# EAGLE design decoderP3-v2 (EAGLE 7.6.0)
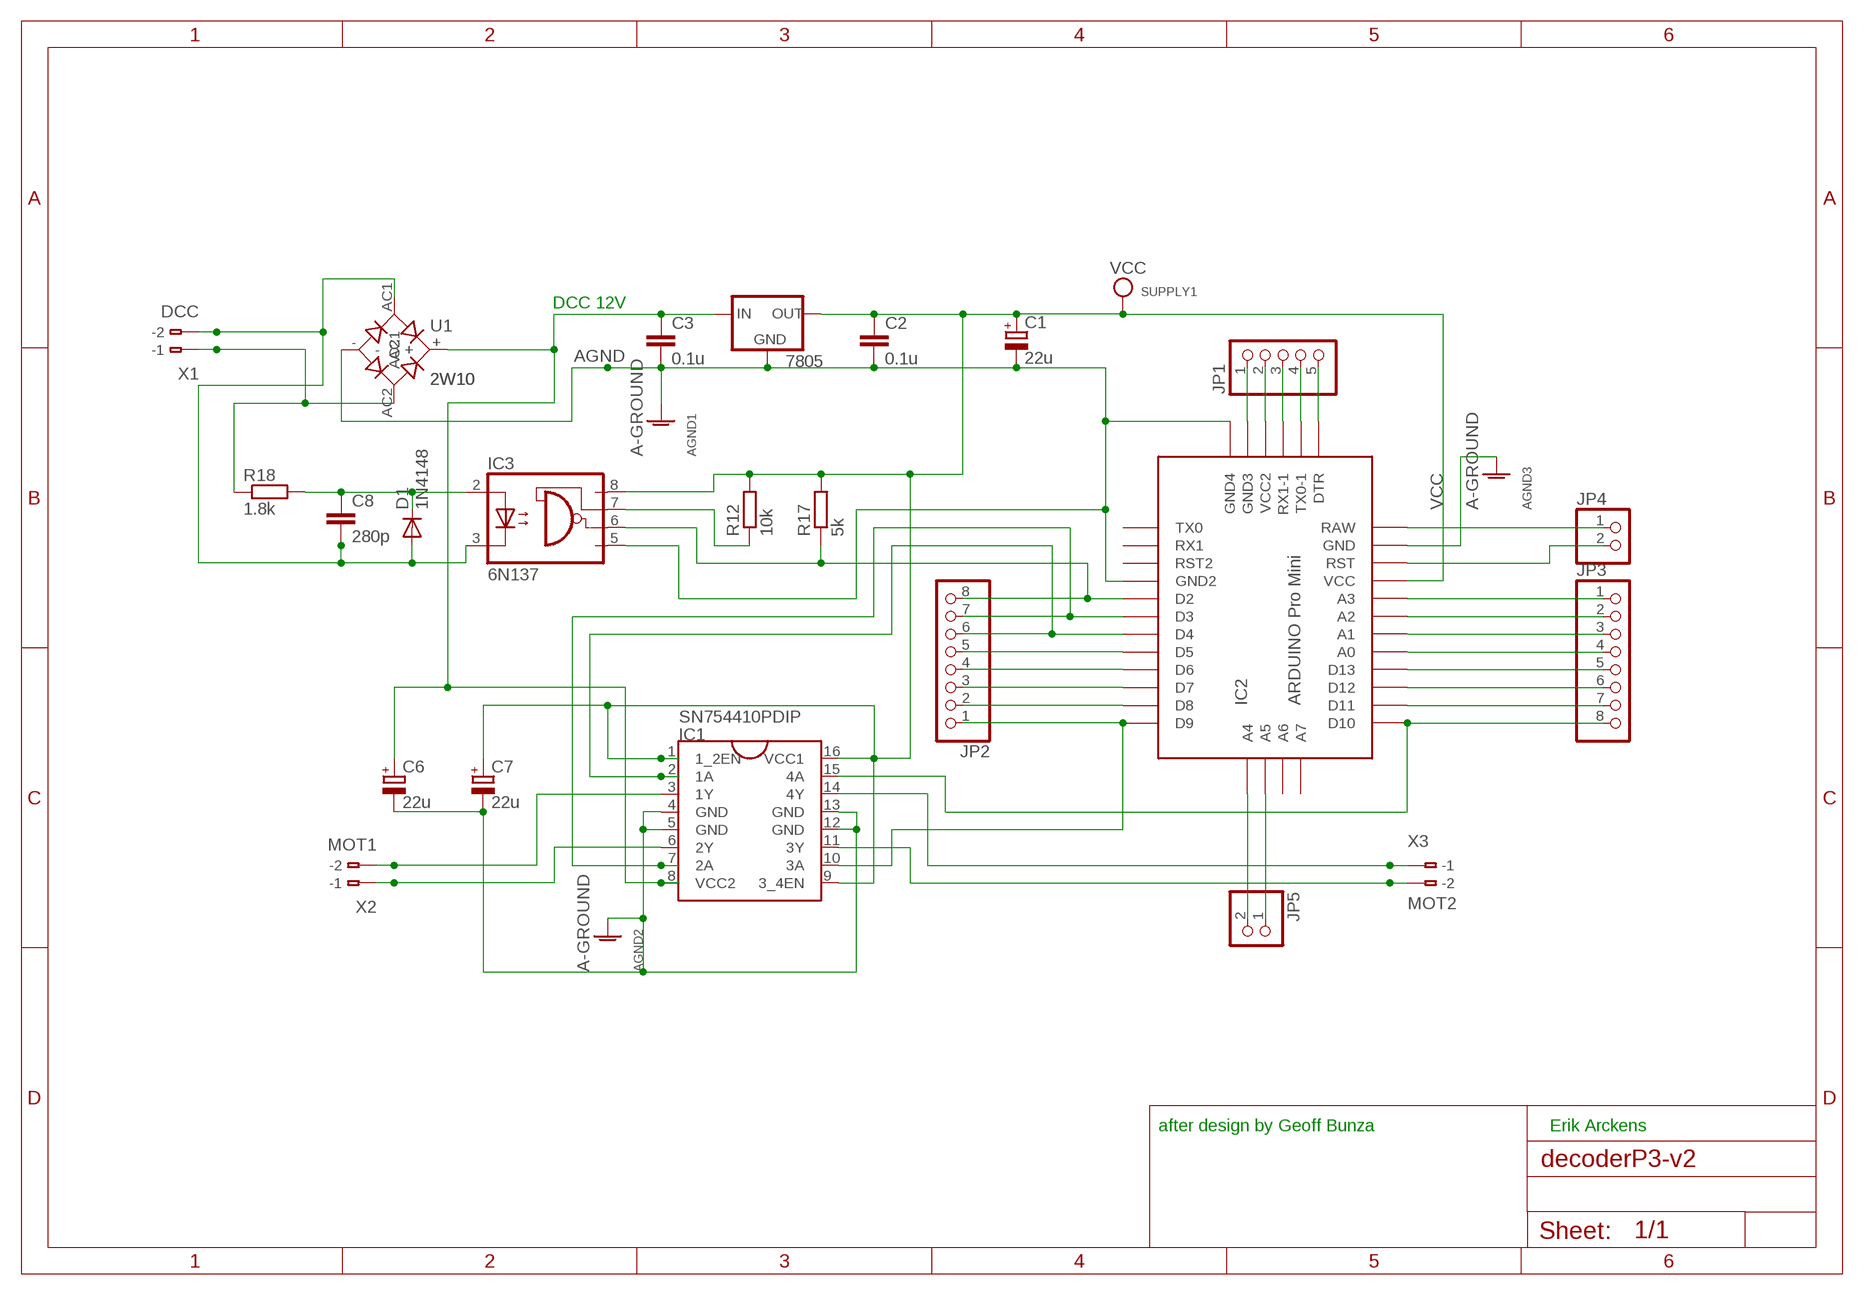
[diagram p0: schematic, sheet 1]

## Parts
7805  78XXS  [78XXS]
C1  22u  ELCOELCO2,5MMLEAD  [ELCO-2.5MMLEAD]
C2  0.1u  CERAMIC-CAP2LEADS  [CERAMIC-CAP-C050-025X075]
C3  0.1u  CERAMIC-CAP2LEADS  [CERAMIC-CAP-C050-025X075]
C6  22u  TANTALUM-SMD-22UF-25V-AVX-CSMD  [AVX-C]
C7  22u  TANTALUM-SMD-22UF-25V-AVX-CSMD  [AVX-C]
C8  280p  CERAMIC-CAP2LEADS  [CERAMIC-CAP-C050-025X075]
D1  1N4148  1N4148-1ADO35-7  [DO35-7-1N4148]
IC1  SN754410PDIP  [DIL16]
IC2  ARDUINO Pro Mini  ARDUINO-PRO-MINI-FULLFULL  [ARDUINO-PRO-MINI-FULL]
IC3  6N137  6N137-OPTOCOUPLER  [DIL08]
JP1  PINHD-1X5  [1X05]
JP2  PINHD-1X8  [1X08]
JP3  PINHD-1X8  [1X08]
JP4  PINHD-1X2  [1X02]
JP5  PINHD-1X2  [1X02]
R12  10k  RESISTOR_1/4W_V  [0207/2V_VERTICAL_1/4W_RESISTOR]
R17  5k  RESISTOR_1/4W_V  [0207/2V_VERTICAL_1/4W_RESISTOR]
R18  1.8k  RESISTOR_1/4W_V  [0207/2V_VERTICAL_1/4W_RESISTOR]
U1  2W10  2W10_BRIDGE_RECTIFIER  [2W10]
X1  DCC  TERMINAL-2POLE-0.1-INCH-SPRINGLOADED  [PCB-TERMINAL-2POLE-0.1-INCH]
X2  MOT1  TERMINAL-2POLE-0.1-INCH-SPRINGLOADED  [PCB-TERMINAL-2POLE-0.1-INCH]
X3  MOT2  TERMINAL-2POLE-0.1-INCH-SPRINGLOADED  [PCB-TERMINAL-2POLE-0.1-INCH]

## Nets
AGND [GND]: 7805.GND C1.- C2.P$1 C3.P$1 C6.- C7.- IC1.4(GND) IC1.5(GND) IC1.12(GND) IC1.13(GND) IC2.GND IC2.GND1(GND2) IC2.GND2(GND4) IC3.5(GND) U1.- ; supply symbol labelled A-GROUND
N$1: C8.P$1 D1.A IC3.3(C) U1.AC1 X1.A2(-2) X1.B2(B-2)
N$2: IC2.D5 JP2.5
N$3: IC2.D6 JP2.4
N$4 [VCC]: 7805.IN C3.P$2 C6.+ IC1.8(VCC2) U1.+
N$5: R18.1 U1.AC2 X1.A1(-1) X1.B1(B-1)
N$6: IC1.2(1A) IC2.D4 JP2.6
N$7: IC2.D7 JP2.3
N$8: IC1.3(1Y) X2.A2(-2) X2.B2(B-2)
N$9: IC1.6(2Y) X2.A1(-1) X2.B1(B-1)
N$10: IC1.11(3Y) X3.A2(-2) X3.B2(B-2)
N$11: IC1.10(3A) IC2.D9 JP2.1
N$12: IC3.7(VE) R12.1
N$13: IC1.7(2A) IC2.D3 JP2.7
N$14: IC2.D8 JP2.2
N$15: IC2.A3 JP3.1
N$16: IC1.15(4A) IC2.D10 JP3.8
N$17: IC1.14(4Y) X3.A1(-1) X3.B1(B-1)
N$18: IC2.A2 JP3.2
N$19: IC2.A1 JP3.3
N$20: IC2.D2 IC3.6(VO) JP2.8 R17.1
N$21: IC2.A0 JP3.4
N$22: IC2.D13 JP3.5
N$23: IC2.D12 JP3.6
N$24: IC2.D11 JP3.7
N$25: IC2.RAW JP4.1
N$26: IC2.RST JP4.2
N$27: IC2.GND3 JP1.1
N$28: IC2.VCC1(VCC2) JP1.2
N$29: IC2.RX1-1 JP1.3
N$30: IC2.TX0-1 JP1.4
N$31: IC2.DTR JP1.5
N$32: IC2.A4 JP5.2
N$33: IC2.A5 JP5.1
N$34: C8.P$2 D1.C IC3.2(A) R18.2
VCC [VCC]: 7805.OUT C1.+ C2.P$2 C7.+ IC1.1(1_2EN) IC1.9(3_4EN) IC1.16(VCC1) IC2.VCC IC3.8(VCC) R12.2 R17.2
Unconnected: IC2.A6 IC2.A7 IC2.RST1(RST2) IC2.RX1 IC2.TX0

## Notes on the sheet
- DCC 12V
- after design by Geoff Bunza | Erik Arckens

## Library data of the parts
7805 = decoderP3 v2:78XXS: VOLTAGE REGULATOR
C1 = decoderP3 v2:ELCO: electrolytic capacitor 3.5mm lead
C2 C3 C8 = decoderP3 v2:CERAMIC-CAP: ceramic capacitor leads 2.5mm and 5.5mm
C6 C7 = decoderP3 v2:TANTALUM-SMD-22UF-25V-AVX-C: Tantalum SMD 22uF 25V
D1 = decoderP3 v2:1N4148-1A: DIODE high speed (Philips)
IC1 = decoderP3 v2:SN754410: SN754410 quadruple half-H bridge driver
IC2 = decoderP3 v2:ARDUINO-PRO-MINI-FULL: Arduion Pro Mini Clone V1.0
IC3 = decoderP3 v2:6N137-OPTOCOUPLER: MOTOROLA OPTO COUPLER; MPN: 6N137; OC_FARNELL: 1328376; OC_NEWARK: 52M1895
JP1 = decoderP3 v2:PINHD-1X5: PIN HEADER
JP2 JP3 = decoderP3 v2:PINHD-1X8: PIN HEADER
JP4 JP5 = decoderP3 v2:PINHD-1X2: 2-PIN HEADER
R12 R17 R18 = decoderP3 v2:RESISTOR_1/4W_V: Resistor 1/4W vertical
U1 = decoderP3 v2:2W10_BRIDGE_RECTIFIER: 2W10 bridge rectifier 2A
X1-X3 = decoderP3 v2:TERMINAL-2POLE-0.1-INCH-SPRINGLOADED: WAGO Cage Clamp; MPN: 233-102; OC_FARNELL: unknown; OC_NEWARK: 28K9044

## Net classes
0 default: width 0.254 mm, clearance 0.203 mm
1 GND: width 0.406 mm, clearance 0.203 mm
2 VCC: width 0.406 mm, clearance 0.203 mm

## Board
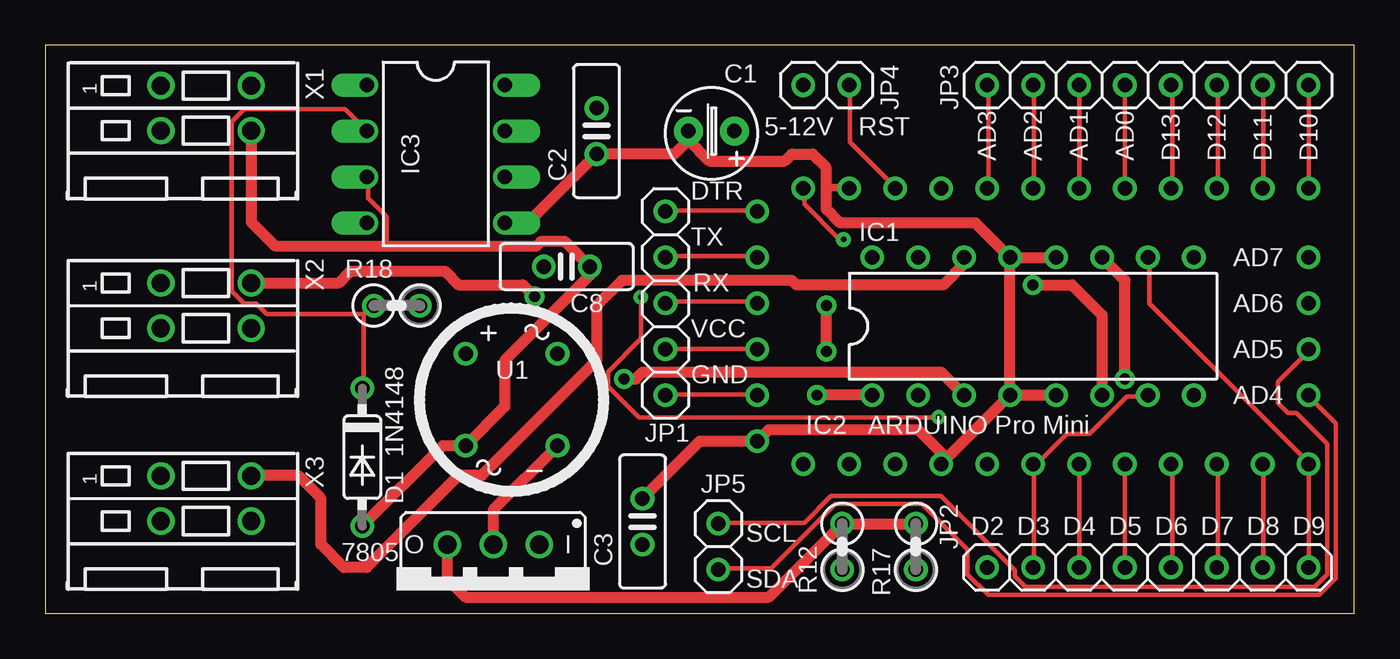
[diagram p1: board, top side]
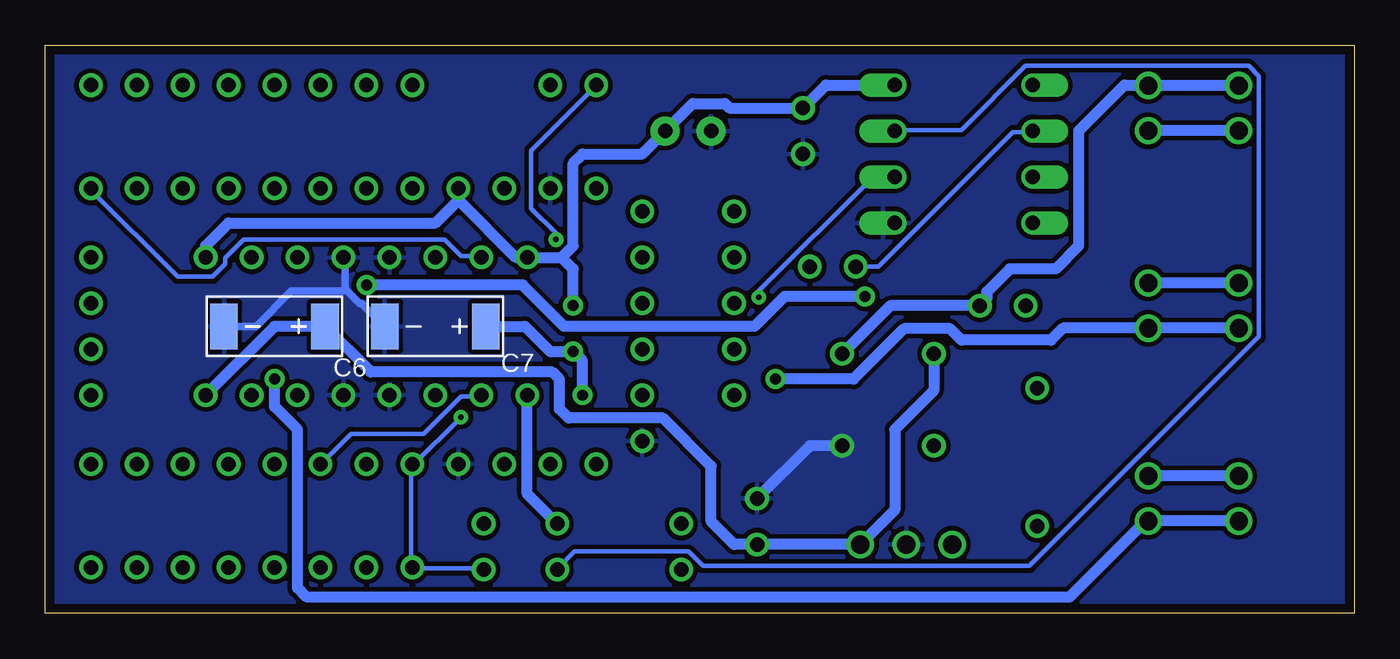
[diagram p2: board, bottom side, seen from below]

Size 72.37 x 31.42 mm. Coordinates in mm from the lower left corner, seen from the top.
Outline: 0,0 72.37,0 72.37,31.42 0,31.42 0,0
Copper layers (1*16): Top 0.035mm / dielectric 1.6mm / Bottom 0.035mm
Design rules "Elecrow_2-layer_PCB_eagle_rule-v2 *": minimum track width 6mil, minimum drill 12mil, track to track 6mil, track to pad 6mil, pad to pad 6mil, via to via 8mil, smd to smd 0mil, copper to edge 20mil, drill to drill 10mil, minimum pad ring 10mil, minimum via ring 10mil, stop-mask expansion 0mil, vias tented up to drill 25mil, thermal gap 10mil

### Footprints (pad centres in the part's own frame; a part is rotated, then mirrored left to right if it is on the bottom)
78XXS = drill 1.016: GND 0,-2.54; IN -2.54,-2.54; OUT 2.54,-2.54
ELCO-2.5MMLEAD = drill 0.8 pad 1.6: + -1.27,0; - 1.27,0
CERAMIC-CAP-C050-025X075 = drill 0.8: P$1 -1.27,0; P$2 1.27,0
AVX-C = smd 1.524 x 2.54: + -2.794,0; - 2.794,0
DO35-7-1N4148 = drill 0.8: A 3.81,0; C -3.81,0
DIL16 = drill 0.8: 1 -8.89,-3.81; 2 -6.35,-3.81; 3 -3.81,-3.81; 4 -1.27,-3.81; 5 1.27,-3.81; 6 3.81,-3.81; 7 6.35,-3.81; 8 8.89,-3.81; 9 8.89,3.81; 10 6.35,3.81; 11 3.81,3.81; 12 1.27,3.81; 13 -1.27,3.81; 14 -3.81,3.81; 15 -6.35,3.81; 16 -8.89,3.81
ARDUINO-PRO-MINI-FULL = drill 0.8: A0 8.89,8.89; A1 8.89,11.43; A2 8.89,13.97; A3 8.89,16.51; A4 -2.54,-1.27; A5 0,-1.27; A6 2.54,-1.27; A7 5.08,-1.27; D2 -6.35,16.51; D3 -6.35,13.97; D4 -6.35,11.43; D5 -6.35,8.89; D6 -6.35,6.35; D7 -6.35,3.81; D8 -6.35,1.27; D9 -6.35,-1.27; D10 8.89,-1.27; D11 8.89,1.27; D12 8.89,3.81; D13 8.89,6.35; DTR 7.62,29.21; GND 8.89,24.13; GND1 -6.35,19.05; GND2 -5.08,29.21; GND3 -2.54,29.21; RAW 8.89,26.67; RST 8.89,21.59; RST1 -6.35,21.59; RX1 -6.35,24.13; RX1-1 2.54,29.21; TX0 -6.35,26.67; TX0-1 5.08,29.21; VCC 8.89,19.05; VCC1 0,29.21
DIL08 = drill 0.8 pad 1.27 offset: 1 -3.81,-3.81; 2 -1.27,-3.81; 3 1.27,-3.81; 4 3.81,-3.81; 5 3.81,3.81; 6 1.27,3.81; 7 -1.27,3.81; 8 -3.81,3.81
1X05 = drill 0.8: 1 -5.08,0; 2 -2.54,0; 3 0,0; 4 2.54,0; 5 5.08,0
1X08 = drill 0.8: 1 -8.89,0; 2 -6.35,0; 3 -3.81,0; 4 -1.27,0; 5 1.27,0; 6 3.81,0; 7 6.35,0; 8 8.89,0
1X02 = drill 0.8: 1 -1.27,0; 2 1.27,0
0207/2V_VERTICAL_1/4W_RESISTOR = drill 0.8: 1 -1.27,0; 2 1.27,0
2W10 = drill 0.8: + -2.54,2.54; - 2.54,-2.54; AC1 -2.54,-2.54; AC2 2.54,2.54
PCB-TERMINAL-2POLE-0.1-INCH = drill 1: A1 -1.25,2.5; A2 1.25,2.5; B1 -1.25,-2.5; B2 1.25,-2.5

### Placement (x,y rotation side)
7805  24.77,1.27 180 top
C1  36.83,26.67 180 top
C2  30.48,26.67 90 top
C3  33.02,5.08 270 top
C6  59.69,15.88 180 bottom
C7  50.8,15.88 180 bottom
C8  28.83,19.18 180 top
D1  17.53,8.64 270 top
IC1  54.61,15.88 0 top
IC2  68.58,14.61 90 top
IC3  21.59,25.4 270 top
JP1  34.29,17.14 90 top
JP2  60.96,2.54 180 top
JP3  60.96,29.21 0 top
JP4  43.18,29.21 0 top
JP5  37.21,3.68 270 top
R12  44.07,3.68 90 top
R17  48.13,3.68 90 top
R18  19.43,17.02 180 top
U1  25.78,11.81 0 top
X1  8.89,27.94 270 top
X2  8.89,17.02 270 top
X3  8.89,6.35 270 top

### Tracks (layer width: path | path; a pad name or v marks a point on that pad's centre or on a via)
AGND
  Top 0.406: 43.18,23.53 44.36,23.53 IC2.GND
  Top 0.61: U1.- 24.77,5.71 7805.GND | C3.P$1 36.2,9.53 IC2.GND2 40.01,10.16 48.26,10.16 49.53,8.89 IC2.GND1 IC1.4 | IC1.4 IC1.5 | IC1.4 IC1.13 | IC1.13 IC1.12 | IC1.13 51.44,21.59 43.94,21.59 43.18,22.35 43.18,23.53 43.18,24.64 42.42,25.4 41.28,25.4 40.89,25.02 36.7,25.02 35.56,26.16 | 35.56,26.16 C1.- | 35.56,26.16 34.8,25.4 C2.P$1 26.67,21.59 IC3.5
  Bottom 0.406: 55.79,17.93 54.99,17.13 54.88,17.13 53.62,15.88 C7.- | 55.79,17.93 55.79,19.65 IC1.12 | C6.- 60.71,15.88 58.76,17.82 55.91,17.82 55.79,17.93
  Bottom 0.61: U1.- 30.1,9.27 C3.P$1
  pour Bottom (isolate 0.254): 0,31.37 72.39,31.37 72.39,31.24 72.26,31.24 72.26,0 0,0
N$1
  Top 0.254: 18.87,20.32 18.87,21.93 17.84,22.96 17.84,24.11 IC3.3
  Top 0.61: X1.A2 11.39,21.63 12.7,20.32 18.87,20.32 27.18,20.32 27.43,20.57 28.7,20.57 C8.P$1 30.1,18.67 25.4,13.97 25.4,11.43 U1.AC1 21.97,9.27 D1.A
  Bottom 0.61: X1.B2 X1.A2
N$2
  Top 0.254: JP2.5 59.68,2.62 59.68,8.22 IC2.D5
N$3
  Top 0.254: JP2.4 62.31,2.62 62.31,8.22 IC2.D6
N$4
  Bottom 0.61: U1.+ 23.24,12.32 25.4,10.16 25.4,5.71 7805.IN C3.P$2 34.29,3.81 35.56,5.08 35.56,8.13 38.23,10.79 43.43,10.79 43.94,11.3 43.94,12.95 44.32,13.34 54.36,13.34 C6.+ 59.69,15.88 IC1.8
N$5
  Bottom 0.61: X1.B1 X1.A1 12.68,29.19 12.7,29.21 15.24,26.67 15.24,20.32 16.51,19.05 19.05,19.05 20.32,17.78 20.32,17.4 R18.1 25.65,17.02 U1.AC2
N$6
  Top 0.254: JP2.6 57.16,2.62 57.16,8.22 IC2.D4
  Bottom 0.254: IC1.2 48.36,11.99 49.39,11.99 51.45,9.93 55.45,9.93 57.05,8.33 IC2.D4
N$7
  Top 0.254: JP2.3 64.82,2.62 64.82,8.22 IC2.D7
N$8  (via drill 0.6)
  Top 0.61: IC1.3 49.53,13.34 33.02,13.34 32.64,12.95 v32,12.95
  Bottom 0.61: X2.B2 X2.A2 16.11,15.77 16.76,15.11 21.72,15.11 22.35,15.75 24.89,15.75 27.69,12.95 v32,12.95
N$9  (via drill 0.6)
  Top 0.61: X2.A1 16.24,18.27 16.89,18.92 22.1,18.92 22.86,18.16 26.42,18.16 v27.05,17.53 | v54.61,18.16 56.77,18.16 58.42,16.51 IC1.6
  Bottom 0.61: X2.B1 X2.A1 | v27.05,17.53 31.5,17.53 33.15,15.88 43.69,15.88 45.97,18.16 v54.61,18.16
N$10  (via drill 0.6)
  Top 0.254: 59.69,13.02 59.68,13.02 v59.69,12.95
  Top 0.61: 59.69,12.7 v59.69,12.95 59.69,13.02 59.69,18.41 IC1.11
  Bottom 0.61: X3.B2 X3.A2 11.54,5.1 15.75,0.89 57.91,0.89 58.42,1.4 58.42,10.16 59.69,11.43 v59.69,12.95
N$11
  Top 0.254: JP2.1 IC2.D9 69.85,8.33 61.05,17.13 61.05,19.65 IC1.10
N$12
  Bottom 0.254: IC3.7 25.39,26.73 21.73,26.73 18.19,30.28 5.84,30.28 5.27,29.71 5.27,15.3 17.96,2.62 36.02,2.62 36.82,3.42 43.1,3.42 44.02,2.5 R12.1
N$13
  Top 0.254: JP2.7 54.65,2.62 54.65,8.22 IC2.D3 54.76,8.22 56.48,9.93 57.73,9.93 59.79,11.99 60.94,11.99 IC1.7
N$14
  Top 0.254: JP2.2 67.33,2.62 67.33,8.22 IC2.D8
N$15
  Top 0.254: IC2.A3 52.13,23.53 52.13,29.13 JP3.1
N$16
  Top 0.254: IC2.D10 JP3.8
  Bottom 0.254: IC1.15 48.36,19.76 49.39,19.76 50.3,20.68 61.39,20.68 62.42,19.65 62.42,19.3 63.11,18.62 65.05,18.62 69.85,23.42 IC2.D10
N$17
  Top 0.254: X3.A1 11.44,7.64 11.44,7.62
  Top 0.61: IC1.14 50.8,19.3 49.66,18.16 41.53,18.16 41.28,18.41 31.88,18.41 30.48,17.02 30.48,13.97 24.13,7.62 22.86,7.62 17.78,2.54 16.51,2.54 15.24,3.81 15.24,6.35 13.97,7.62 11.44,7.62 11.43,7.62
  Bottom 0.61: X3.B1 X3.A1
N$18
  Top 0.254: IC2.A2 54.65,23.53 54.65,29.13 JP3.2
N$19
  Top 0.254: IC2.A1 57.16,23.53 57.16,29.13 JP3.3
N$20  (via drill 0.3)
  Top 0.254: v32.93,17.48 32.93,15.19 31.1,13.36 31.1,12.56 32.82,10.85 v49.39,10.85
  Bottom 0.254: R17.1 48.13,2.5 52.02,2.5 JP2.8 52.13,2.62 52.13,8.22 IC2.D2 52.02,8.22 v49.39,10.85 | v32.93,17.48 32.93,17.82 26.64,24.11 25.5,24.11 IC3.6
N$21
  Top 0.254: IC2.A0 59.68,23.53 59.68,29.13 JP3.4
N$22
  Top 0.254: IC2.D13 62.31,23.53 62.31,29.13 JP3.5
N$23
  Top 0.254: IC2.D12 64.82,23.53 64.82,29.13 JP3.6
N$24
  Top 0.254: IC2.D11 67.33,23.53 67.33,29.13 JP3.7
N$25  (via drill 0.3)
  Top 0.254: v44.13,20.68 43.9,20.68 41.96,22.62 41.96,23.42 IC2.RAW
  Bottom 0.254: v44.13,20.68 44.13,21.02 45.5,22.39 45.5,25.59 41.96,29.13 JP4.1
N$26
  Top 0.254: JP4.2 44.48,29.13 44.48,26.05 46.99,23.53 IC2.RST
N$27
  Top 0.254: JP1.1 34.3,12.1 39.33,12.1 IC2.GND3
N$28
  Top 0.254: JP1.2 34.3,14.62 39.33,14.62 IC2.VCC1
N$29
  Top 0.254: JP1.3 34.3,17.25 39.33,17.25 IC2.RX1-1
N$30
  Top 0.254: JP1.4 34.3,19.76 39.33,19.76 IC2.TX0-1
N$31
  Top 0.254: JP1.5 34.3,22.28 39.33,22.28 IC2.DTR
N$32
  Top 0.254: JP5.2 37.28,2.5 40.13,2.5 43.68,6.04 48.48,6.04 50.99,3.53 50.99,2.16 52.13,1.02 70.42,1.02 71.34,1.93 71.34,10.5 69.85,11.99 IC2.A4
N$33
  Top 0.254: JP5.1 37.28,5.02 41.96,5.02 43.45,6.5 49.51,6.5 53.62,2.39 53.62,2.04 54.19,1.47 70.19,1.47 70.88,2.16 70.88,9.36 69.16,11.07 68.71,11.07 68.13,11.65 68.13,12.79 69.85,14.5 IC2.A5
N$34
  Top 0.254: 17.61,16.56 17.61,12.45 D1.C | 17.61,16.56 18.07,17.02 R18.2 | 17.61,16.56 12.24,16.56 11.67,17.13 10.99,17.13 10.3,17.82 10.3,27.19 10.99,27.88 16.59,27.88 17.73,26.73 IC3.2
  Bottom 0.254: IC3.2 17.84,26.62 18.87,26.62 26.3,19.19 C8.P$2
VCC  (via drill 0.6)
  Top 0.61: 7805.OUT 22.22,1.9 23.24,0.89 40.01,0.89 R12.2 R17.2 | v43.18,14.48 v43.18,17.02 | IC1.1 v42.67,12.07
  Bottom 0.61: R12.2 45.72,6.6 IC1.1 | IC1.9 63.5,20.32 62.23,21.59 50.8,21.59 49.53,22.86 | IC2.VCC 49.53,22.86 | 49.53,22.86 46.36,19.68 IC1.16 43.82,19.68 | 43.82,19.68 43.18,20.32 43.18,24.89 42.67,25.4 39.37,25.4 C1.+ 36.58,28.19 34.8,28.19 34.54,27.94 C2.P$2 29.21,29.21 IC3.8 | C7.+ 45.85,15.88 44.45,14.48 v43.18,14.48 42.67,13.97 v42.67,12.07 | v43.18,17.02 43.18,19.05 43.82,19.68

### Text on the board
tPlace: 5-12V | RST | AD3 | AD2 | AD1 | AD0 | D13 | D12 | D11 | D10 | DTR | TX | AD7 | RX | AD6 | VCC | AD5 | GND | AD4 | D2 | D3 | D4 | D5 | D6 | D7 | D8 | D9 | SCL | SDA